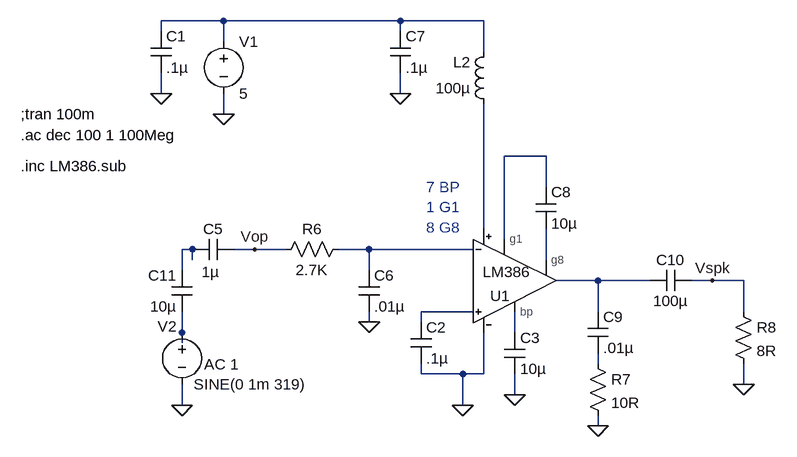
[diagram p0: schematic LM386 Audio Amp.asc]
LM386 Audio Amp.asc, the LTspice schematic file:
Version 4
SHEET 1 880 680
WIRE -480 -128 -576 -128
WIRE -208 -128 -480 -128
WIRE -80 -128 -208 -128
WIRE -576 -112 -576 -128
WIRE -208 -112 -208 -128
WIRE -480 -96 -480 -128
WIRE -80 -80 -80 -128
WIRE -576 -16 -576 -48
WIRE -208 -16 -208 -48
WIRE -480 16 -480 -16
WIRE 16 80 -48 80
WIRE 16 128 16 80
WIRE -80 192 -80 0
WIRE -48 208 -48 80
WIRE -528 224 -544 224
WIRE -432 224 -464 224
WIRE -384 224 -432 224
WIRE -256 224 -304 224
WIRE -96 224 -256 224
WIRE -528 240 -528 224
WIRE 16 240 16 192
WIRE -544 256 -544 224
WIRE -256 256 -256 224
WIRE 96 272 32 272
WIRE 176 272 96 272
WIRE 272 272 240 272
WIRE 320 272 272 272
WIRE -96 320 -176 320
WIRE 96 320 96 272
WIRE 320 320 320 272
WIRE -256 336 -256 320
WIRE -176 336 -176 320
WIRE -544 352 -544 320
WIRE -32 352 -32 320
WIRE -544 368 -544 352
WIRE 96 400 96 384
WIRE -176 416 -176 400
WIRE -112 416 -176 416
WIRE -80 416 -80 352
WIRE -80 416 -112 416
WIRE 320 432 320 400
WIRE -32 448 -32 416
WIRE -544 464 -544 432
WIRE -112 464 -112 416
WIRE 96 496 96 480
FLAG -480 16 0
FLAG -576 -16 0
FLAG -432 224 Vop
FLAG -256 336 0
FLAG -208 -16 0
FLAG -112 464 0
FLAG 96 496 0
FLAG 320 432 0
FLAG -544 464 0
FLAG 272 272 Vspk
FLAG -32 448 0
SYMBOL LM386 -32 272 R0
WINDOW 3 -49 -13 Left 2
WINDOW 0 -38 24 Left 2
SYMATTR InstName U1
SYMBOL voltage -480 -112 R0
WINDOW 123 0 0 Left 2
WINDOW 39 0 0 Left 2
SYMATTR InstName V1
SYMATTR Value 5
SYMBOL cap -592 -112 R0
SYMATTR InstName C1
SYMATTR Value .1µ
SYMBOL cap -464 208 R90
WINDOW 0 0 32 VBottom 2
WINDOW 3 35 36 VTop 2
SYMATTR InstName C5
SYMATTR Value 1µ
SYMBOL cap -272 256 R0
SYMATTR InstName C6
SYMATTR Value .01µ
SYMBOL ind -64 16 R180
WINDOW 0 36 80 Left 2
WINDOW 3 36 40 Left 2
SYMATTR InstName L2
SYMATTR Value 100µ
SYMBOL cap -224 -112 R0
SYMATTR InstName C7
SYMATTR Value .1µ
SYMBOL cap 0 128 R0
SYMATTR InstName C8
SYMATTR Value 10µ
SYMBOL res -288 208 R90
WINDOW 0 0 56 VBottom 2
WINDOW 3 32 56 VTop 2
SYMATTR InstName R6
SYMATTR Value 2.7K
SYMBOL cap 80 320 R0
SYMATTR InstName C9
SYMATTR Value .01µ
SYMBOL res 80 384 R0
SYMATTR InstName R7
SYMATTR Value 10R
SYMBOL cap 240 256 R90
WINDOW 0 0 32 VBottom 2
WINDOW 3 32 32 VTop 2
SYMATTR InstName C10
SYMATTR Value 100µ
SYMBOL res 304 304 R0
SYMATTR InstName R8
SYMATTR Value 8R
SYMBOL voltage -544 336 R0
WINDOW 3 18 96 Left 2
WINDOW 123 34 65 Left 2
WINDOW 39 0 0 Left 2
WINDOW 0 -37 7 Left 2
SYMATTR Value SINE(0 1m 319)
SYMATTR Value2 AC 1
SYMATTR InstName V2
SYMBOL cap -528 320 R180
WINDOW 0 24 56 Left 2
WINDOW 3 24 8 Left 2
SYMATTR InstName C11
SYMATTR Value 10µ
SYMBOL cap -192 336 R0
SYMATTR InstName C2
SYMATTR Value .1µ
SYMBOL cap -48 352 R0
SYMATTR InstName C3
SYMATTR Value 10µ
TEXT -168 128 Left 2 ;7 BP\n1 G1\n8 G8
TEXT -792 48 Left 2 !.ac dec 100 1 100Meg
TEXT -792 16 Left 2 !;tran 100m
TEXT -792 96 Left 2 !.inc LM386.sub

The netlist it stands for:
* LM386 Audio Amp.asc
XU1 N002 N005 N008 0 N007 N003 N010 N006 LM386 LM386  ; pins g1 In- In+ V- OUT V+ bp g8
V1 N001 0 5
C1 N001 0 .1µ
C5 Vop N004 1µ
C6 N005 0 .01µ
L2 N003 N001 100µ
C7 N001 0 .1µ
C8 N002 N006 10µ
R6 N005 Vop 2.7K
C9 N007 N011 .01µ
R7 N011 0 10R
C10 Vspk N007 100µ
R8 Vspk 0 8R
V2 N009 0 SINE(0 1m 319) AC 1
C11 N009 N004 10µ
C2 N008 0 .1µ
C3 N010 0 10µ
* 7 BP
* 1 G1
* 8 G8
.ac dec 100 1 100Meg
;tran 100m
.inc LM386.sub
.lib LM386.sub
.backanno
.end